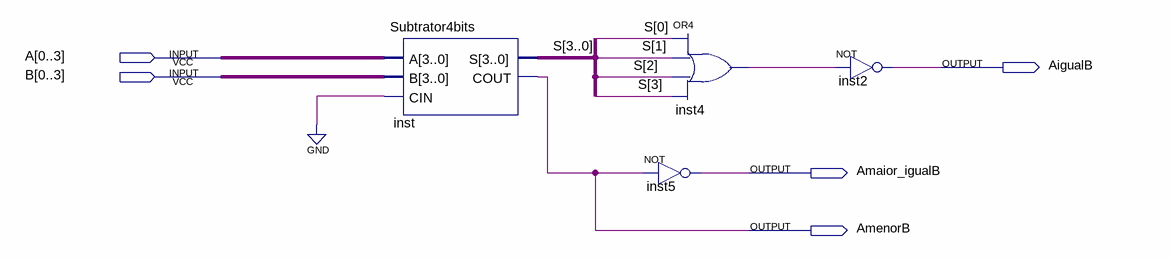
[diagram p0: schematic sheet]
// Quartus schematic Comparador.bdf as structural Verilog: 4 symbols, 5 pins
module Comparador (
  input  [0:3] A,
  input  [0:3] B,
  output AigualB,
  output Amaior_igualB,
  output AmenorB
);

  wire inst4_out;
  wire [3:0] S;

  Subtrator4bits inst (.A(A), .B(B), .CIN(1'b0), .S(S), .COUT(AmenorB));
  or inst4 (inst4_out, S[0], S[1], S[2], S[3]);
  not inst5 (Amaior_igualB, AmenorB);
  not inst2 (AigualB, inst4_out);
endmodule
